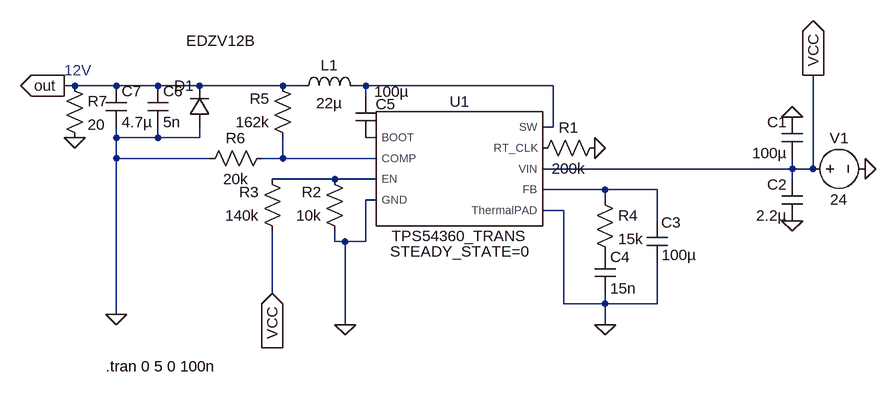
[diagram p0: schematic TPS54360_test_12V.asc]
TPS54360_test_12V.asc, the LTspice schematic file:
Version 4.1
SHEET 1 880 680
WIRE -368 -16 -384 -16
WIRE -304 -16 -368 -16
WIRE -240 -16 -304 -16
WIRE -176 -16 -240 -16
WIRE -48 -16 -176 -16
WIRE -16 -16 -48 -16
WIRE 80 -16 64 -16
WIRE 368 -16 80 -16
WIRE 80 0 80 -16
WIRE 368 48 368 -16
WIRE 368 48 352 48
WIRE -304 64 -304 48
WIRE -240 64 -240 48
WIRE -240 64 -304 64
WIRE -176 64 -176 48
WIRE -176 64 -240 64
WIRE 96 64 80 64
WIRE -304 96 -304 64
WIRE -160 96 -304 96
WIRE -48 96 -48 64
WIRE -48 96 -80 96
WIRE 96 96 -48 96
WIRE 736 112 736 96
WIRE 736 112 352 112
WIRE 768 112 768 -32
WIRE 768 112 736 112
WIRE 32 128 -64 128
WIRE 96 128 32 128
WIRE 736 128 736 112
WIRE 448 144 352 144
WIRE 528 144 448 144
WIRE 96 160 80 160
WIRE 448 160 448 144
WIRE 384 176 352 176
WIRE 528 192 528 144
WIRE 32 224 32 208
WIRE 48 224 32 224
WIRE 80 224 80 160
WIRE 80 224 48 224
WIRE -64 304 -64 208
WIRE 384 320 384 176
WIRE 448 320 448 304
WIRE 448 320 384 320
WIRE 528 320 528 256
WIRE 528 320 448 320
WIRE -304 336 -304 96
WIRE 48 352 48 224
WIRE 448 352 448 320
FLAG 736 32 0
FLAG 736 192 0
FLAG 848 112 0
FLAG 432 80 0
FLAG 768 -32 VCC
IOPIN 768 -32 Out
FLAG -64 304 VCC
IOPIN -64 304 In
FLAG 48 352 0
FLAG 448 352 0
FLAG -304 336 0
FLAG -384 -16 out
IOPIN -384 -16 Out
FLAG -368 64 0
SYMBOL voltage 752 112 R270
WINDOW 0 32 56 VTop 2
WINDOW 3 -32 56 VBottom 2
WINDOW 123 0 0 Left 0
WINDOW 39 -60 56 VBottom 2
SYMATTR InstName V1
SYMATTR Value 24
SYMBOL cap 752 96 R180
WINDOW 0 24 56 Left 2
WINDOW 3 24 8 Left 2
SYMATTR InstName C1
SYMATTR Value 100µ
SYMBOL cap 752 192 R180
WINDOW 0 24 56 Left 2
WINDOW 3 24 8 Left 2
SYMATTR InstName C2
SYMATTR Value 2.2µ
SYMBOL res 448 64 R90
WINDOW 0 0 56 VBottom 2
WINDOW 3 32 56 VTop 2
SYMATTR InstName R1
SYMATTR Value 200k
SYMBOL res 48 224 R180
WINDOW 0 36 76 Left 2
WINDOW 3 36 40 Left 2
SYMATTR InstName R2
SYMATTR Value 10k
SYMBOL res -48 224 R180
WINDOW 0 36 76 Left 2
WINDOW 3 36 40 Left 2
SYMATTR InstName R3
SYMATTR Value 140k
SYMBOL cap 544 256 R180
WINDOW 0 -21 61 Left 2
WINDOW 3 -45 11 Left 2
SYMATTR InstName C3
SYMATTR Value 100µ
SYMBOL res 432 144 R0
SYMATTR InstName R4
SYMATTR Value 15k
SYMBOL cap 432 240 R0
SYMATTR InstName C4
SYMATTR Value 15n
SYMBOL cap 64 0 R0
WINDOW 0 31 12 Left 2
WINDOW 3 29 -7 Left 2
SYMATTR InstName C5
SYMATTR Value 100µ
SYMBOL ind -32 0 R270
WINDOW 0 32 56 VTop 2
WINDOW 3 5 56 VBottom 2
SYMATTR InstName L1
SYMATTR Value 22µ
SYMBOL diode -160 48 R180
WINDOW 0 24 64 Left 2
WINDOW 3 -70 133 Left 2
SYMATTR InstName D1
SYMATTR Value EDZV12B
SYMBOL cap -256 -16 R0
SYMATTR InstName C6
SYMATTR Value 5n
SYMBOL cap -320 -16 R0
SYMATTR InstName C7
SYMATTR Value 4.7µ
SYMBOL res -32 80 R180
WINDOW 0 36 76 Left 2
WINDOW 3 36 40 Left 2
SYMATTR InstName R5
SYMATTR Value 162k
SYMBOL res -64 80 R90
WINDOW 0 0 56 VBottom 2
WINDOW 3 32 56 VTop 2
SYMATTR InstName R6
SYMATTR Value 20k
SYMBOL TPS54360_TRANS 224 112 R0
SYMATTR InstName U1
SYMBOL res -384 -32 R0
SYMATTR InstName R7
SYMATTR Value 20
TEXT -320 416 Left 2 !.tran 0 5 0 100n
TEXT -384 -40 Left 2 ;12V

The netlist it stands for:
* TPS54360_test_12V.asc
V1 VCC 0 24
C1 VCC 0 100µ
C2 0 VCC 2.2µ
R1 0 P001 200k
R2 0 N004 10k
R3 VCC N004 140k
C3 0 N005 100µ
R4 N005 P002 15k
C4 P002 0 15n
C5 N001 N002 100µ
L1 out N001 22µ
D1 0 out EDZV12B
C6 out 0 5n
C7 out 0 4.7µ
R5 N003 out 162k
R6 N003 0 20k
X§U1 N002 N003 N004 0 N001 P001 VCC N005 0 TPS54360_TRANS STEADY_STATE=0  ; pins BOOT COMP EN GND SW RT_CLK VIN FB ThermalPAD
R7 out 0 20
.model D D
.lib standard.dio
.tran 0 5 0 100n
* 12V
.lib C:\GitHub\Robotic_Manipulator_HSPS\hardware\simulations\spice_models\dc_dc\TPS54360_PSPICE_TRANS\TPS54360_TRANS.LIB
.backanno
.end